# EasyEDA Pro project PCB-WearableGasDetect.epro, board PCB7
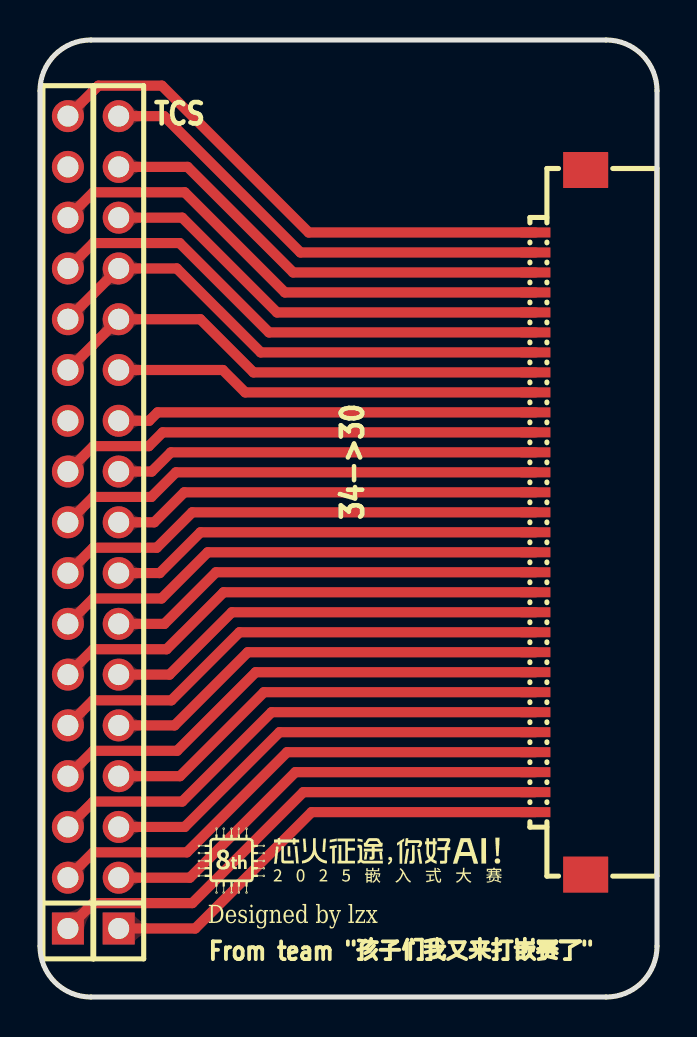
[diagram p8: board, top side]
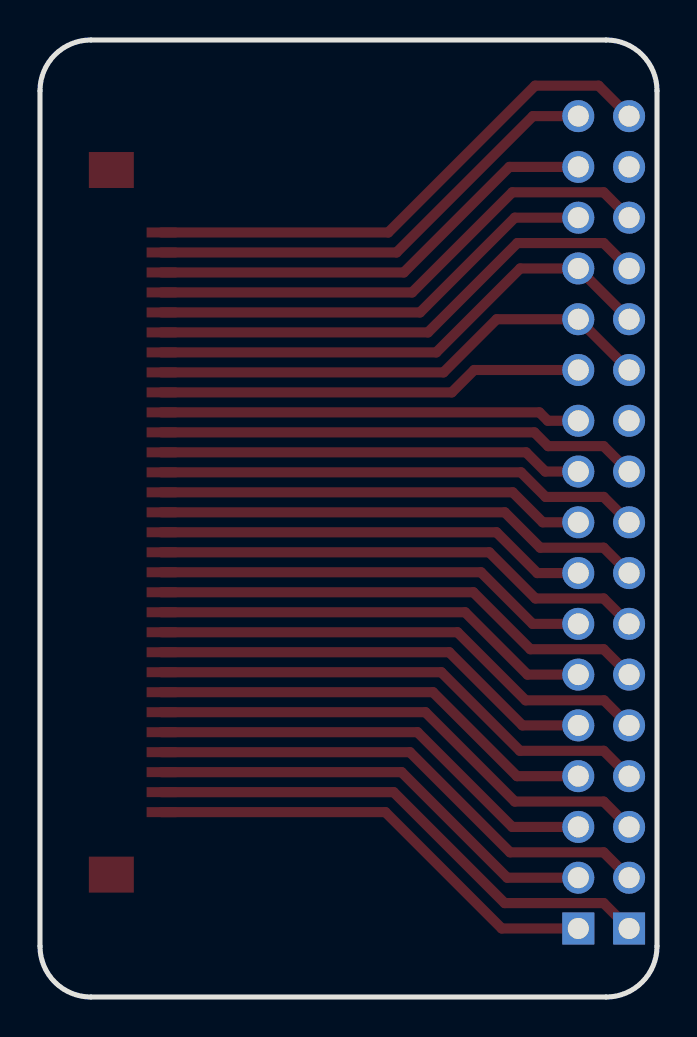
[diagram p9: board, bottom side, seen from below]

Outline 30.86 x 47.88 mm; copper layers: Top Layer, Bottom Layer. Coordinates in mm from the lower left corner of the outline.
Outline path: 0,45.34 0,2.54 arc(0.74,0.74) 2.54,0 28.32,0 arc(30.12,0.74) 30.86,2.54 30.86,45.34 arc(30.12,47.14) 28.32,47.88 2.54,47.88 arc(0.74,47.14) 0,45.34
Stack: Top Layer 0.035mm / Dielectric1 1.51mm FR4 er 4.5 / Bottom Layer 0.035mm

## Design rules (mm)
template: JLCPCB Capability(Two Layers Board)
spacing copperThickness1oz (default): track to track 0.102, other pairs 0.152 to 0.3
spacing copperThickness2oz: track to track 0.203, other pairs 0.152 to 0.3
track width copperThickness1oz (default): min 0.127, default 0.254, max 2.54
track width copperThickness2oz: min 0.203, default 0.254, max 2.54
differential pair differentialPair (default): width min 0.127, default 0.254, max 2.54; gap min 0.152, default 0.152
via viaSize (default): diameter min 0.5, default 0.61, max 10; hole min 0.3, default 0.305, max 6.3

## Placement (name value [footprint] x y rotation side)
H1  -  [HDR-TH_17P-P2.54-V-F]  3.94 23.75 90 top
H2  -  [HDR-TH_17P-P2.54-V-F]  1.4 23.75 90 top
U1  FFC-30P_1.0MM_HF  [FPC-SMD_30P-P1.00_C9900049190]  26.03 23.75 90 top

## Footprints (pads in the part's own frame, mm; a bottom-side part is the same pattern mirrored in y, then rotated)
FPC-SMD_30P-P1.00_C9900049190
  rect 0.5x1.5 smd: 1(-14.5,1.256) 2(-13.5,1.256) 3(-12.5,1.256) 4(-11.5,1.256) 5(-10.5,1.256) 6(-9.5,1.256) 7(-8.5,1.256) 8(-7.5,1.256) 9(-6.5,1.256) 10(-5.5,1.256) 11(-4.5,1.256) 12(-3.5,1.256) 13(-2.5,1.256) 14(-1.5,1.256) 15(-0.5,1.256) 16(0.5,1.256) 17(1.5,1.256) 18(2.5,1.256) 19(3.5,1.256) 20(4.5,1.256) 21(5.5,1.256) 22(6.5,1.256) 23(7.5,1.256) 24(8.5,1.256) 25(9.5,1.256) 26(10.5,1.256) 27(11.5,1.256) 28(12.5,1.256) 29(13.5,1.256) 30(14.5,1.256)
  rect 1.8x2.25 smd: 31(17.625,-1.256) 32(-17.625,-1.256)
HDR-TH_17P-P2.54-V-F
  rect 1.6x1.6 hole 1.05: 1(-20.32,0)
  round 1.6 hole 1.05: 2(-17.78,0) 3(-15.24,0) 4(-12.7,0) 5(-10.16,0) 6(-7.62,0) 7(-5.08,0) 8(-2.54,0) 9(0,0) 10(2.54,0) 11(5.08,0) 12(7.62,0) 13(10.16,0) 14(12.7,0) 15(15.24,0) 16(17.78,0) 17(20.32,0)

## Nets
As in the schematic.

Pads without a net: H2 11 16

## Routing (per net, layer and track width the routed paths; a pad name or vN(x,y) marks a point on that pad's centre or on a via; arc(x,y) is an arc through that point)
5V: length 25.8
  Top Layer w0.508: H2.14 2.67,37.72 6.99,37.72 11.46,33.25 U1.25
GND: length 26.2
  Top Layer w0.508: U1.24 11.04,32.25 6.84,36.45 H1.14 H2.13
VDD: length 25.5
  Top Layer w0.508: H2.12 H1.13 8.02,33.91 10.68,31.25 U1.23
BL: length 21.3
  Top Layer w0.508: U1.22 10.26,30.25 9.14,31.37 H1.12
CLK: length 27.1
  Top Layer w0.508: U1.30 13.44,38.25 6.1,45.59 2.92,45.59 H2.17
CS: length 23.3
  Top Layer w0.508: H1.1 7.76,3.43 13.58,9.25 U1.1
D1: length 25.8
  Top Layer w0.508: U1.6 11.58,14.25 7.11,9.78 2.67,9.78 H2.3
D2: length 22.6
  Top Layer w0.508: U1.7 11.2,15.25 7,11.05 H1.4
D3: length 25.5
  Top Layer w0.508: H2.4 2.67,12.32 6.86,12.32 10.79,16.25 U1.8
D4: length 22.4
  Top Layer w0.508: H1.5 6.73,13.59 10.39,17.25 U1.9
D5: length 25.3
  Top Layer w0.508: H2.5 2.65,14.84 6.57,14.84 9.98,18.25 U1.10
D6: length 22.1
  Top Layer w0.508: U1.11 9.6,19.25 6.48,16.13 H1.6
D7: length 25.1
  Top Layer w0.508: U1.12 9.18,20.25 6.33,17.4 2.67,17.4 H2.6
D8: length 21.9
  Top Layer w0.508: H1.7 6.22,18.67 8.8,21.25 U1.13
D10: length 24.9
  Top Layer w0.508: H2.7 2.67,19.94 6.08,19.94 8.39,22.25 U1.14
D11: length 21.7
  Top Layer w0.508: H1.8 5.99,21.21 8.03,23.25 U1.15
D12: length 24.6
  Top Layer w0.508: H2.8 2.67,22.48 5.84,22.48 7.61,24.25 U1.16
D13: length 21.5
  Top Layer w0.508: U1.17 7.22,25.25 5.72,23.75 H1.9
D14: length 24.4
  Top Layer w0.508: H2.9 2.67,25.02 5.57,25.02 6.8,26.25 U1.18
D15: length 21.2
  Top Layer w0.508: U1.19 6.55,27.25 5.59,26.29 H1.10
D16: length 24.2
  Top Layer w0.508: H2.10 2.67,27.56 5.44,27.56 6.13,28.25 U1.20
D17: length 21
  Top Layer w0.508: H1.11 5.46,28.83 5.88,29.25 U1.21
MI: length 26
  Top Layer w0.508: U1.27 12.25,35.25 7.24,40.26 2.67,40.26 H2.15
MO: length 22.8
  Top Layer w0.508: H1.15 7.11,38.99 11.85,34.25 U1.26
PEN: length 23
  Top Layer w0.508: U1.28 12.66,36.25 7.38,41.53 H1.16
RD: length 26
  Top Layer w0.508: H2.2 2.67,7.24 7.35,7.24 12.36,12.25 U1.4
RS: length 26.2
  Top Layer w0.508: U1.2 13.17,10.25 7.62,4.7 2.67,4.7 H2.1
RST: length 22.8
  Top Layer w0.508: H1.3 7.24,8.51 11.98,13.25 U1.5
TCS: length 23.7
  Top Layer w0.508: H1.17 6.21,44.07 13.03,37.25 U1.29
WR: length 23
  Top Layer w0.508: H1.2 7.49,5.97 12.77,11.25 U1.3

## Copper pours and planes (outline as drawn; the poured copper is in the pictures)
GND on Top Layer: -5.71,51.05 36.2,51.05 36.2,-1.02 -5.71,-1.02
GND on Bottom Layer: -7.75,52.07 37.34,52.07 37.34,-4.06 -7.75,-4.06

Small or netless copper shapes (teardrops, artwork), in the pictures only: 34 on Top Layer

## Text on the board
Top Silkscreen Layer: TCS | 34->30 | From team "孩子们我又来打嵌赛了" | Designed by lzx
